# EasyEDA Pro project ProPrj_Y车Y形板_2025-09-30.epro, board DCDC
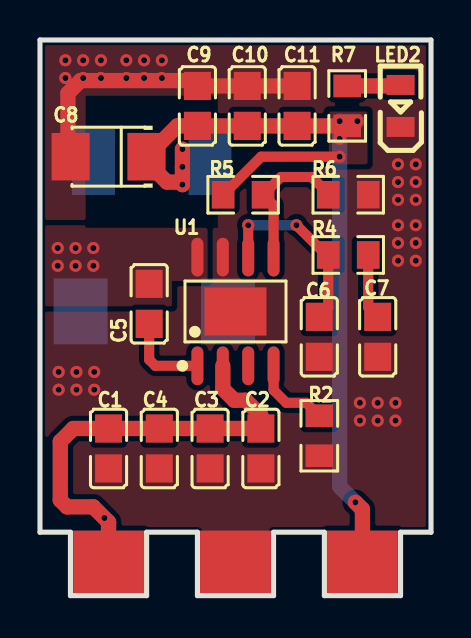
[diagram p8: board, top side]
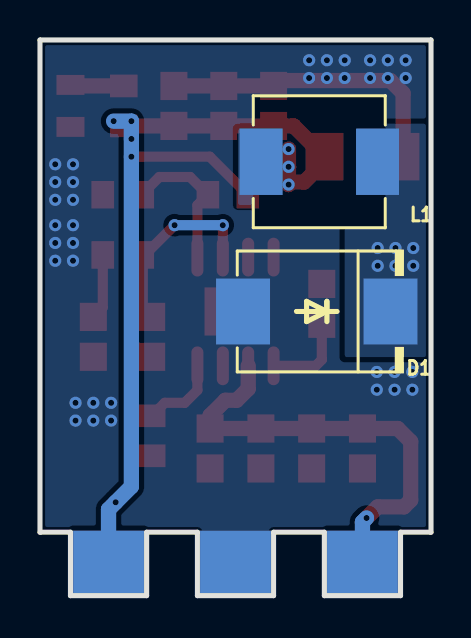
[diagram p9: board, bottom side, seen from below]

Outline 19.56 x 27.81 mm; copper layers: Top Layer, Bottom Layer. Coordinates in mm from the lower left corner of the outline.
Outline path: 0,27.81 19.56,27.81 19.56,3.17 18.03,3.17 18.03,0 14.22,0 14.22,3.17 11.68,3.17 11.68,0 7.87,0 7.87,3.17 5.33,3.17 5.33,0 1.52,0 1.52,3.17 0,3.17 0,27.81
Stack: Top Layer 0.035mm / Dielectric1 1.51mm FR4 er 4.5 / Bottom Layer 0.035mm

## Design rules (mm)
template: 自定义配置
spacing copperThickness1oz (default): track to track 0.102, other pairs 0.152 to 0.3
spacing copperThickness2oz: track to track 0.203, other pairs 0.152 to 0.3
track width copperThickness1oz (default): min 0.127, default 0.254, max 2.54
track width copperThickness2oz: min 0.203, default 0.254, max 2.54
differential pair differentialPair (default): width min 0.127, default 0.254, max 2.54; gap min 0.152, default 0.152
via viaSize (default): diameter min 0.5, default 0.61, max 10; hole min 0.3, default 0.305, max 6.3

## Placement (name value [footprint] x y rotation side)
C1  4.7uF  [C0805]  3.43 7.37 90 top
C2  4.7uF  [C0805]  11.05 7.37 90 top
C3  4.7uF  [C0805]  8.51 7.37 90 top
C4  4.7uF  [C0805]  5.97 7.37 90 top
C5  1UF  [C0805]  5.46 14.6 90 top
C6  43pF  [C0805]  13.97 12.95 90 top
C7  620pF  [C0805]  16.89 12.95 90 top
C8  47uF  [CAP-SMD_L3.5-W2.8-R-RD]  3.43 21.97 0 top
C9  100nF  [C0805]  7.87 24.51 270 top
C10  100nF  [C0805]  10.37 24.51 270 top
C11  100nF  [C0805]  12.86 24.51 270 top
D1  SS86  [SMC_L6.9-W5.9-LS7.9-RD]  5.72 14.22 0 bottom
L1  15uH  [IND-SMD_L7.1-W6.6]  5.59 21.72 0 bottom
LED2  NCD0805R1  [LED0805-R-RD]  18.03 24.51 90 top
NOREF  -  [Pad_e66]  9.78 1.65 0 top
NOREF#2  -  [Pad_e62]  9.78 1.65 0 top
NOREF#3  -  [Pad_e68]  16.13 1.65 0 top
NOREF#4  -  [Pad_e69]  16.13 1.65 0 top
NOREF#5  -  [Pad_e64]  3.43 1.65 0 top
NOREF#6  -  [Pad_e60]  3.43 1.65 0 top
R2  75kΩ  [R0805]  13.97 8 90 top
R4  18.7kΩ  [R0805]  15.42 17.05 180 top
R5  52.3kΩ  [R0805]  10.16 20.07 0 top
R6  10kΩ  [R0805]  15.42 20.07 180 top
R7  4.7kΩ  [R0805]  15.37 24.51 270 top
U1  TPS54540DDAR  [SOIC-8_L4.9-W3.9-P1.27-LS6.0-BL-EP]  9.78 14.22 0 top

## Footprints (pads in the part's own frame, mm; a bottom-side part is the same pattern mirrored in y, then rotated)
C0805
  rect 1.41x1.35 smd: 1(-1,0) 2(1,0)
CAP-SMD_L3.5-W2.8-R-RD
  rect 1.9x2.376 smd: 1(1.899,0) 2(-1.899,0)
IND-SMD_L7.1-W6.6
  rect 2.15x3.32 smd: 1(-2.913,0) 2(2.913,0)
LED0805-R-RD
  rect 1x1.399 smd: 1(1.05,0) 2(-1.05,0)
Pad_e60
  rect 3.54x3.2 smd: 1(0,0)
Pad_e62
  rect 3.54x3.2 smd: 2(0,0)
Pad_e64
  rect 3.54x3.2 smd far side: 1(0,0)
Pad_e66
  rect 3.54x3.2 smd far side: 2(0,0)
Pad_e68
  rect 3.54x3.2 smd: 3(0,0)
Pad_e69
  rect 3.54x3.2 smd far side: 3(0,0)
R0805
  rect 1.133x1.377 smd: 1(-1,0) 2(1,0)
SMC_L6.9-W5.9-LS7.9-RD
  rect 2.7x3.3 smd: 1(-3.687,0) 2(3.687,0)
SOIC-8_L4.9-W3.9-P1.27-LS6.0-BL-EP
  oval 0.602x1.941 smd: 1(-1.905,-2.72) 2(-0.635,-2.72) 3(0.635,-2.72) 4(1.905,-2.72) 5(1.905,2.72) 6(0.635,2.72) 7(-0.635,2.72) 8(-1.905,2.72)
  rect 3.098x2.41 smd: 9(0,0)

## Nets
GND: C1.1 C2.1 C3.1 C4.1 C6.1 C7.1 C8.2 C9.1 C10.1 C11.1 D1.2 LED2.2 NOREF.2 NOREF#2.2 R2.1 R6.1 U1.7 U1.9
VCC5V: C8.1 C9.2 C10.2 C11.2 L1.2 NOREF#3.3 NOREF#4.3 R5.1 R7.2
VCCBAT: C1.2 C2.2 C3.2 C4.2 NOREF#5.1 NOREF#6.1 U1.2
$1N887: R2.2 U1.4
$1N888: C5.1 U1.1
$1N889: C5.2 D1.1 L1.1 U1.8
$1N890: C6.2 R4.2 U1.6
$1N891: C7.2 R4.1
$1N892: R5.2 R6.2 U1.5
$1N987: LED2.1 R7.1

Pads without a net: U1 3

## Via types
v1: diameter 0.61, hole 0.305, Top Layer to Bottom Layer, 53 vias

## Routing (per net, layer and track width the routed paths; a pad name or vN(x,y) marks a point on that pad's centre or on a via; arc(x,y) is an arc through that point)
GND: length 15.1
  Top Layer w0.762: C8.2 1.4,22.1 1.4,25.15 2.03,25.78 7.6,25.78 C9.1 C10.1 C11.1
  vias: v1(0.93,11.2) v1(0.93,10.31) v1(1.27,26.8) v1(1.27,25.91) v1(1.82,11.2) v1(1.82,10.31) v1(2.16,26.8) v1(2.16,25.91) v1(2.71,11.2) v1(2.71,10.31) v1(3.05,26.8) v1(3.05,25.91) v1(4.32,26.8) v1(4.32,25.91) v1(5.21,26.8) v1(5.21,25.91) v1(6.1,26.8) v1(6.1,25.91) v1(16,9.65) v1(16,8.76) v1(16.89,9.65) v1(16.89,8.76) v1(17.78,9.65) v1(17.78,8.76) v1(17.91,21.59) v1(17.91,20.7) v1(17.91,19.81) v1(17.91,18.54) v1(17.91,17.65) v1(17.91,16.76) v1(18.8,21.59) v1(18.8,20.7) v1(18.8,19.81) v1(18.8,18.54) v1(18.8,17.65) v1(18.8,16.76)
VCC5V: length 48.2
  Top Layer w0.508: R5.1 11.06,21.97 v1(14.99,21.97)
  Top Layer w0.762: v1(15.77,4.67) 16.13,4.32 NOREF#3.3 ; v1(7.12,22.35) v1(7.12,21.46) v1(7.12,20.57) 7,20.7 6.35,20.7 5.33,21.72 C8.1 6.87,23.51 C9.2 C10.2 C11.2 R7.2
  Bottom Layer w0.762: v1(15.87,23.75) v1(14.99,23.75) v1(14.99,22.86) v1(14.99,21.97) 14.99,5.46 v1(15.77,4.67) 16.13,4.32 NOREF#3.3
VCCBAT: length 24.7
  Top Layer w0.762: NOREF#5.1 3.43,3.68 2.67,4.44 1.35,4.44 1.02,4.78 1.02,7.72 1.67,8.37 C1.2 C4.2 C3.2 C2.2 11.05,9.02 10.29,9.78 9.72,9.78 9.14,10.35 U1.2
  Bottom Layer w0.762: v1(3.22,3.89) 3.43,3.68 NOREF#5.1
$1N887: length 4
  Top Layer w0.508: U1.4 11.68,10.29 12.32,9.65 13.32,9.65 R2.2
$1N888: length 4.3
  Top Layer w0.508: C5.1 5.46,11.81 5.77,11.5 U1.1
$1N889:
  vias: v1(0.89,17.4) v1(0.89,16.51) v1(1.78,17.4) v1(1.78,16.51) v1(2.67,17.4) v1(2.67,16.51)
$1N890: length 9.5
  Top Layer w0.508: C6.2 14.42,14.4 R4.2 14.32,17.05 v1(12.83,18.54) ; 10.41,16.94 v1(10.41,18.54)
  Bottom Layer w0.508: v1(10.41,18.54) v1(12.83,18.54)
$1N891: length 3.3
  Top Layer w0.508: R4.1 16.42,14.43 C7.2
$1N892: length 7.4
  Top Layer w0.508: R6.2 14.42,20.13 13.59,20.95 12.05,20.95 R5.2 11.68,19.54 U1.5
$1N987: length 2.7
  Top Layer w0.762: LED2.1 17.98,25.51 R7.1

## Copper pours and planes (outline as drawn; the poured copper is in the pictures)
GND on Top Layer: -1.52,29.46 21.08,29.46 21.08,-3.05 -1.52,-3.05
GND on Bottom Layer: -4.7,28.19 25.65,28.19 25.65,1.78 -4.7,1.78
VCC5V on Top Layer: 14.45,24.23 16.38,24.23 16.38,21.59 14.45,21.59
VCC5V on Bottom Layer: 6.48,23.37 9.65,23.37 9.65,19.56 6.48,19.56
$1N889 on Top Layer: 8.38,18.54 8.38,15.75 6.6,15.75 6.6,14.48 0.13,14.48 0.13,18.54
$1N889 on Bottom Layer: 0,23.62 4.32,23.62 4.32,11.94 0,11.94
